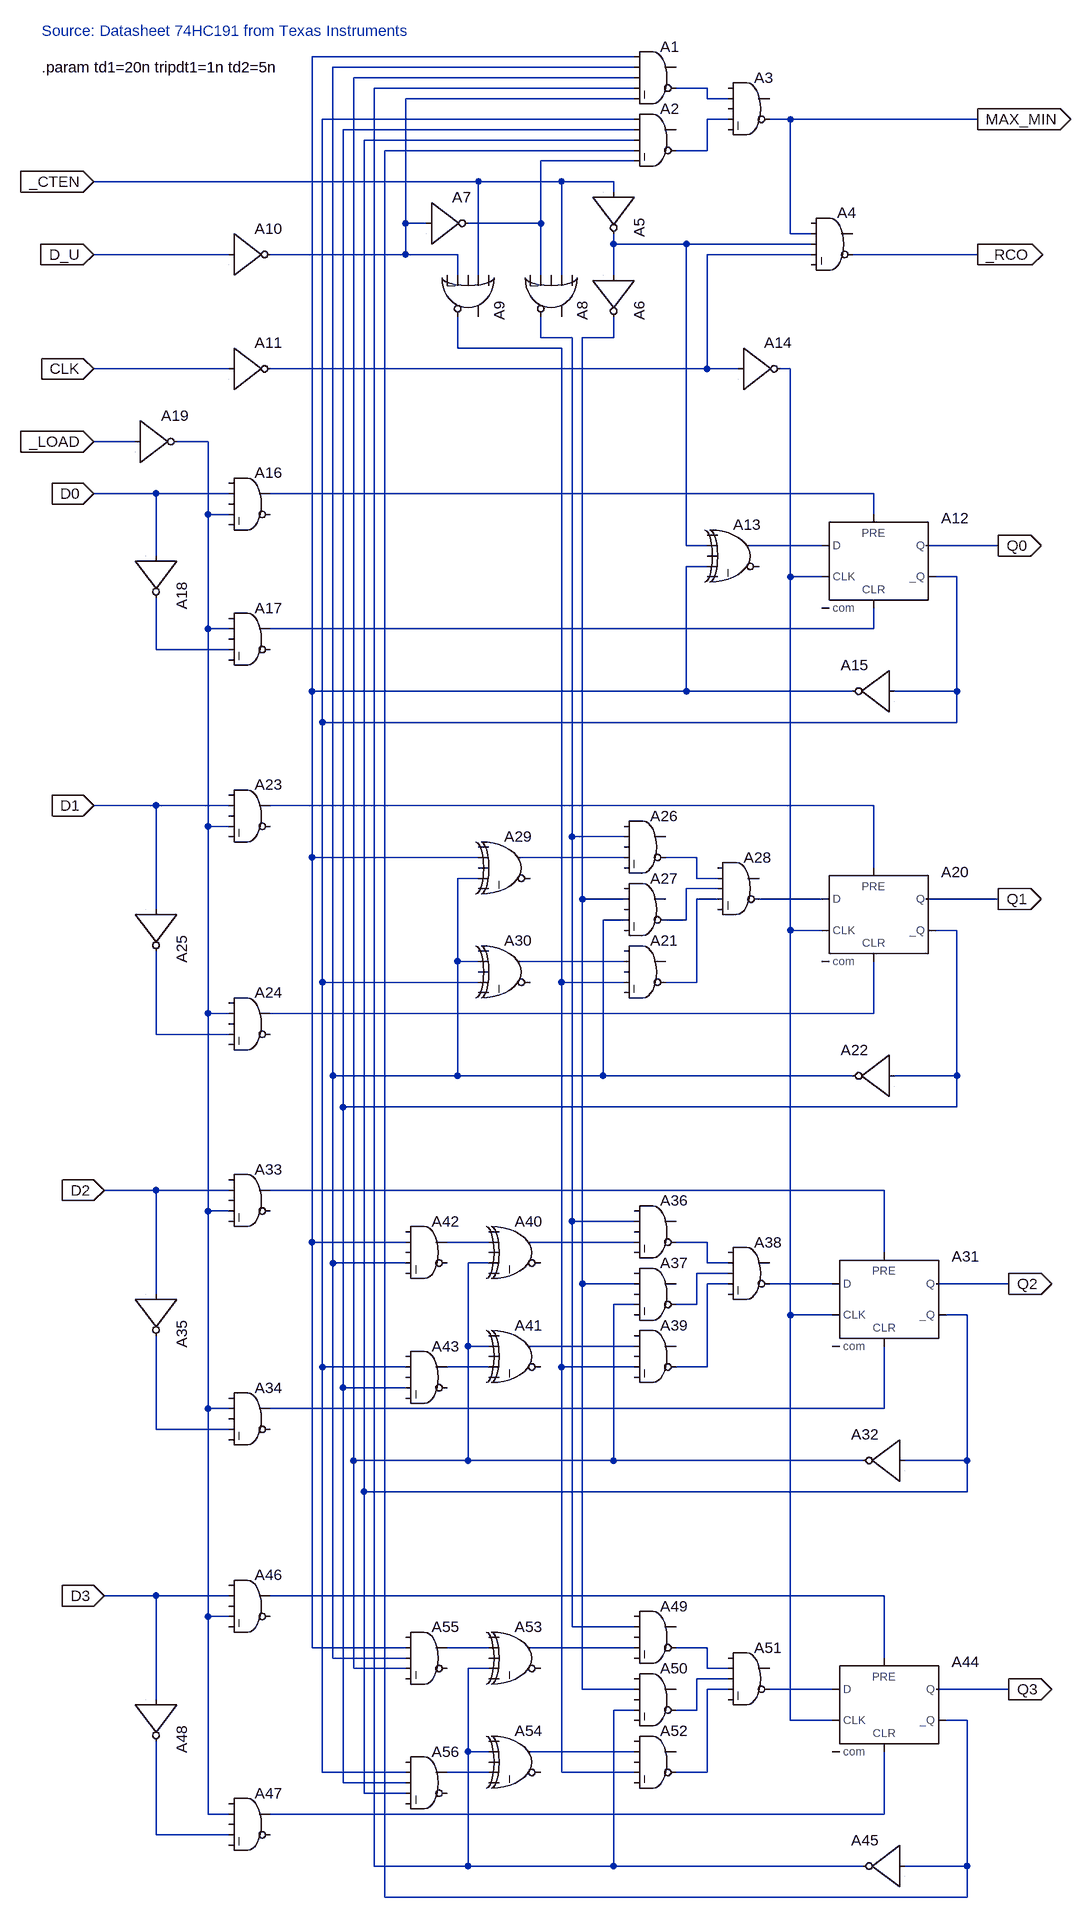
[diagram p0: schematic 74HC191h.asc]
74HC191h.asc, the LTspice schematic file:
Version 4
SHEET 1 884 3140
WIRE -592 624 -656 624
WIRE -560 704 -656 704
WIRE -560 800 -560 704
WIRE -560 944 -560 864
WIRE -560 1184 -656 1184
WIRE -560 1344 -560 1184
WIRE -560 1536 -560 1408
WIRE -560 1776 -640 1776
WIRE -560 1936 -560 1776
WIRE -560 2144 -560 2000
WIRE -560 2400 -640 2400
WIRE -560 2560 -560 2400
WIRE -560 2768 -560 2624
WIRE -480 624 -528 624
WIRE -480 736 -480 624
WIRE -480 912 -480 736
WIRE -480 1216 -480 912
WIRE -480 1504 -480 1216
WIRE -480 1808 -480 1504
WIRE -480 2112 -480 1808
WIRE -480 2432 -480 2112
WIRE -480 2736 -480 2432
WIRE -448 336 -656 336
WIRE -448 512 -656 512
WIRE -448 704 -560 704
WIRE -448 736 -480 736
WIRE -448 912 -480 912
WIRE -448 944 -560 944
WIRE -448 1184 -560 1184
WIRE -448 1216 -480 1216
WIRE -448 1504 -480 1504
WIRE -448 1536 -560 1536
WIRE -448 1776 -560 1776
WIRE -448 1808 -480 1808
WIRE -448 2112 -480 2112
WIRE -448 2144 -560 2144
WIRE -448 2400 -560 2400
WIRE -448 2432 -480 2432
WIRE -448 2736 -480 2736
WIRE -448 2768 -560 2768
WIRE -320 1008 -320 32
WIRE -320 1264 -320 1008
WIRE -320 1856 -320 1264
WIRE -320 2480 -320 1856
WIRE -304 1056 -304 128
WIRE -304 1456 -304 1056
WIRE -304 2048 -304 1456
WIRE -304 2672 -304 2048
WIRE -288 1600 -288 48
WIRE -288 1888 -288 1600
WIRE -288 2496 -288 1888
WIRE -272 1648 -272 144
WIRE -272 2080 -272 1648
WIRE -272 2688 -272 2080
WIRE -256 2192 -256 64
WIRE -256 2512 -256 2192
WIRE -240 2240 -240 160
WIRE -240 2704 -240 2240
WIRE -224 2816 -224 80
WIRE -208 2864 -208 176
WIRE -176 288 -176 96
WIRE -176 336 -384 336
WIRE -176 336 -176 288
WIRE -176 1856 -320 1856
WIRE -176 1888 -288 1888
WIRE -176 2048 -304 2048
WIRE -176 2080 -272 2080
WIRE -176 2480 -320 2480
WIRE -176 2496 -288 2496
WIRE -176 2512 -256 2512
WIRE -176 2672 -304 2672
WIRE -176 2688 -272 2688
WIRE -176 2704 -240 2704
WIRE -144 288 -176 288
WIRE -96 336 -176 336
WIRE -96 368 -96 336
WIRE -96 480 -96 432
WIRE -96 1424 -96 1296
WIRE -96 1600 -288 1600
WIRE -96 1600 -96 1424
WIRE -80 2016 -80 1888
WIRE -80 2192 -256 2192
WIRE -80 2192 -80 2016
WIRE -80 2640 -80 2512
WIRE -80 2816 -224 2816
WIRE -80 2816 -80 2640
WIRE -64 224 -656 224
WIRE -64 368 -64 224
WIRE -64 1264 -320 1264
WIRE -64 1296 -96 1296
WIRE -64 1424 -96 1424
WIRE -64 1456 -304 1456
WIRE -48 1856 -112 1856
WIRE -48 1888 -80 1888
WIRE -48 2016 -80 2016
WIRE -48 2048 -112 2048
WIRE -48 2480 -112 2480
WIRE -48 2512 -80 2512
WIRE -48 2640 -80 2640
WIRE -48 2672 -112 2672
WIRE 32 288 -80 288
WIRE 32 288 32 192
WIRE 32 368 32 288
WIRE 32 464 32 432
WIRE 64 224 -64 224
WIRE 64 368 64 224
WIRE 64 480 -96 480
WIRE 64 1456 64 480
WIRE 64 2048 64 1456
WIRE 64 2672 64 2048
WIRE 80 464 32 464
WIRE 80 1232 80 464
WIRE 80 1824 80 1232
WIRE 80 2448 80 1824
WIRE 96 1328 96 464
WIRE 96 1920 96 1328
WIRE 96 2544 96 1920
WIRE 128 1600 -96 1600
WIRE 128 1600 128 1360
WIRE 144 224 64 224
WIRE 144 240 144 224
WIRE 144 320 144 304
WIRE 144 368 144 320
WIRE 144 464 96 464
WIRE 144 464 144 432
WIRE 144 2192 -80 2192
WIRE 144 2192 144 1952
WIRE 144 2816 -80 2816
WIRE 144 2816 144 2576
WIRE 160 1232 80 1232
WIRE 160 1264 0 1264
WIRE 160 1328 96 1328
WIRE 160 1360 128 1360
WIRE 160 1424 0 1424
WIRE 160 1456 64 1456
WIRE 176 32 -320 32
WIRE 176 48 -288 48
WIRE 176 64 -256 64
WIRE 176 80 -224 80
WIRE 176 96 -176 96
WIRE 176 128 -304 128
WIRE 176 144 -272 144
WIRE 176 160 -240 160
WIRE 176 176 -208 176
WIRE 176 192 32 192
WIRE 176 1824 80 1824
WIRE 176 1856 16 1856
WIRE 176 1920 96 1920
WIRE 176 1952 144 1952
WIRE 176 2016 16 2016
WIRE 176 2048 64 2048
WIRE 176 2448 80 2448
WIRE 176 2480 16 2480
WIRE 176 2544 96 2544
WIRE 176 2576 144 2576
WIRE 176 2640 16 2640
WIRE 176 2672 64 2672
WIRE 256 320 144 320
WIRE 256 784 256 320
WIRE 256 1008 -320 1008
WIRE 256 1008 256 816
WIRE 256 1360 224 1360
WIRE 256 1360 256 1312
WIRE 272 1264 224 1264
WIRE 272 1296 272 1264
WIRE 272 1456 224 1456
WIRE 272 1456 272 1328
WIRE 272 1952 240 1952
WIRE 272 1952 272 1904
WIRE 272 2576 240 2576
WIRE 272 2576 272 2528
WIRE 288 80 240 80
WIRE 288 96 288 80
WIRE 288 176 240 176
WIRE 288 176 288 128
WIRE 288 512 -384 512
WIRE 288 512 288 336
WIRE 288 784 256 784
WIRE 288 816 256 816
WIRE 288 1856 240 1856
WIRE 288 1888 288 1856
WIRE 288 2048 240 2048
WIRE 288 2048 288 1920
WIRE 288 2480 240 2480
WIRE 288 2512 288 2480
WIRE 288 2672 240 2672
WIRE 288 2672 288 2544
WIRE 304 1296 272 1296
WIRE 304 1312 256 1312
WIRE 304 1328 272 1328
WIRE 320 96 288 96
WIRE 320 128 288 128
WIRE 320 1888 288 1888
WIRE 320 1904 272 1904
WIRE 320 1920 288 1920
WIRE 320 2512 288 2512
WIRE 320 2528 272 2528
WIRE 320 2544 288 2544
WIRE 336 512 288 512
WIRE 416 128 384 128
WIRE 416 304 416 128
WIRE 416 512 400 512
WIRE 416 832 416 512
WIRE 416 1376 416 832
WIRE 416 1968 416 1376
WIRE 416 2592 416 1968
WIRE 448 304 416 304
WIRE 448 320 256 320
WIRE 448 336 288 336
WIRE 464 784 352 784
WIRE 464 832 416 832
WIRE 464 1328 368 1328
WIRE 464 1376 416 1376
WIRE 480 1920 384 1920
WIRE 480 1968 416 1968
WIRE 480 2544 384 2544
WIRE 480 2592 416 2592
WIRE 512 1008 256 1008
WIRE 512 1600 128 1600
WIRE 528 2192 144 2192
WIRE 528 2816 144 2816
WIRE 544 704 -384 704
WIRE 544 736 544 704
WIRE 544 912 -384 912
WIRE 544 912 544 880
WIRE 544 1184 -384 1184
WIRE 544 1280 544 1184
WIRE 544 1504 -384 1504
WIRE 544 1504 544 1424
WIRE 560 1776 -384 1776
WIRE 560 1872 560 1776
WIRE 560 2112 -384 2112
WIRE 560 2112 560 2016
WIRE 560 2400 -384 2400
WIRE 560 2496 560 2400
WIRE 560 2736 -384 2736
WIRE 560 2736 560 2640
WIRE 672 832 640 832
WIRE 672 1008 576 1008
WIRE 672 1008 672 832
WIRE 672 1056 -304 1056
WIRE 672 1056 672 1008
WIRE 672 1376 640 1376
WIRE 672 1600 576 1600
WIRE 672 1600 672 1376
WIRE 672 1648 -272 1648
WIRE 672 1648 672 1600
WIRE 688 1968 656 1968
WIRE 688 2192 592 2192
WIRE 688 2192 688 1968
WIRE 688 2240 -240 2240
WIRE 688 2240 688 2192
WIRE 688 2592 656 2592
WIRE 688 2816 592 2816
WIRE 688 2816 688 2592
WIRE 688 2864 -208 2864
WIRE 688 2864 688 2816
WIRE 704 128 416 128
WIRE 704 336 512 336
WIRE 736 784 624 784
WIRE 736 1328 624 1328
WIRE 752 1920 640 1920
WIRE 752 2544 640 2544
FLAG -656 224 _CTEN
IOPIN -656 224 In
FLAG -656 336 D_U
IOPIN -656 336 In
FLAG -656 512 CLK
IOPIN -656 512 In
FLAG -656 624 _LOAD
IOPIN -656 624 In
FLAG -656 704 D0
IOPIN -656 704 In
FLAG -656 1184 D1
IOPIN -656 1184 In
FLAG -640 1776 D2
IOPIN -640 1776 In
FLAG 704 128 MAX_MIN
IOPIN 704 128 Out
FLAG 704 336 _RCO
IOPIN 704 336 Out
FLAG 736 784 Q0
IOPIN 736 784 Out
FLAG 736 1328 Q1
IOPIN 736 1328 Out
FLAG 752 1920 Q2
IOPIN 752 1920 Out
FLAG 752 2544 Q3
IOPIN 752 2544 Out
FLAG -640 2400 D3
IOPIN -640 2400 In
SYMBOL Digital\\and 208 0 R0
SYMATTR InstName A1
SYMATTR Value2 tripdt={tripdt1}  td={td2}
SYMBOL Digital\\and 208 96 R0
SYMATTR InstName A2
SYMATTR Value2 tripdt={tripdt1}  td={td2}
SYMBOL Digital\\and 352 48 R0
SYMATTR InstName A3
SYMATTR Value2 tripdt={tripdt1}  td={td2}
SYMBOL Digital\\and 480 256 R0
SYMATTR InstName A4
SYMATTR Value2 tripdt={tripdt1}  td={td2}
SYMBOL Digital\\inv 208 240 R90
SYMATTR InstName A5
SYMATTR Value2 tripdt={tripdt1}  td={td2}
SYMBOL Digital\\inv 208 368 R90
SYMATTR InstName A6
SYMATTR Value2 tripdt={tripdt1}  td={td2}
SYMBOL Digital\\inv -144 224 R0
SYMATTR InstName A7
SYMBOL Digital\\or 112 400 R90
SYMATTR InstName A8
SYMATTR Value2 tripdt={tripdt1}  td={td2}
SYMBOL Digital\\or -16 400 R90
SYMATTR InstName A9
SYMATTR Value2 tripdt={tripdt1}  td={td2}
SYMBOL Digital\\inv -448 272 R0
SYMATTR InstName A10
SYMATTR Value2 tripdt={tripdt1}  td={td2}
SYMBOL Digital\\inv -448 448 R0
SYMATTR InstName A11
SYMATTR Value2 tripdt={tripdt1}  td={td2}
SYMBOL Digital\\dflop 544 736 R0
SYMATTR InstName A12
SYMATTR Value2 tripdt={tripdt1}  td={td1}
SYMBOL Digital\\xor 336 736 R0
SYMATTR InstName A13
SYMATTR Value2 tripdt={tripdt1}  td={td2}
SYMBOL Digital\\inv 576 944 M0
SYMATTR InstName A15
SYMBOL Digital\\inv 336 448 R0
SYMATTR InstName A14
SYMBOL Digital\\and -416 656 R0
SYMATTR InstName A16
SYMATTR Value2 tripdt={tripdt1}  td={td2}
SYMBOL Digital\\and -416 864 R0
SYMATTR InstName A17
SYMATTR Value2 tripdt={tripdt1}  td={td2}
SYMBOL Digital\\inv -496 800 R90
SYMATTR InstName A18
SYMBOL Digital\\inv -592 560 R0
SYMATTR InstName A19
SYMATTR Value2 tripdt={tripdt1}  td={td2}
SYMBOL Digital\\dflop 544 1280 R0
SYMATTR InstName A20
SYMATTR Value2 tripdt={tripdt1}  td={td1}
SYMBOL Digital\\inv 576 1536 M0
SYMATTR InstName A22
SYMBOL Digital\\and -416 1136 R0
SYMATTR InstName A23
SYMATTR Value2 tripdt={tripdt1}  td={td2}
SYMBOL Digital\\and -416 1456 R0
SYMATTR InstName A24
SYMATTR Value2 tripdt={tripdt1}  td={td2}
SYMBOL Digital\\inv -496 1344 R90
SYMATTR InstName A25
SYMBOL Digital\\and 192 1184 R0
SYMATTR InstName A26
SYMATTR Value2 tripdt={tripdt1}  td={td2}
SYMBOL Digital\\and 192 1280 R0
SYMATTR InstName A27
SYMATTR Value2 tripdt={tripdt1}  td={td2}
SYMBOL Digital\\and 336 1248 R0
SYMATTR InstName A28
SYMATTR Value2 tripdt={tripdt1}  td={td2}
SYMBOL Digital\\and 192 1376 R0
SYMATTR InstName A21
SYMATTR Value2 tripdt={tripdt1}  td={td2}
SYMBOL Digital\\xor -16 1216 R0
SYMATTR InstName A29
SYMATTR Value2 tripdt={tripdt1}  td={td2}
SYMBOL Digital\\xor -16 1376 R0
SYMATTR InstName A30
SYMATTR Value2 tripdt={tripdt1}  td={td2}
SYMBOL Digital\\dflop 560 1872 R0
SYMATTR InstName A31
SYMATTR Value2 tripdt={tripdt1}  td={td1}
SYMBOL Digital\\inv 592 2128 M0
SYMATTR InstName A32
SYMBOL Digital\\and -416 1728 R0
SYMATTR InstName A33
SYMATTR Value2 tripdt={tripdt1}  td={td2}
SYMBOL Digital\\and -416 2064 R0
SYMATTR InstName A34
SYMATTR Value2 tripdt={tripdt1}  td={td2}
SYMBOL Digital\\inv -496 1936 R90
SYMATTR InstName A35
SYMBOL Digital\\and 208 1776 R0
SYMATTR InstName A36
SYMATTR Value2 tripdt={tripdt1}  td={td2}
SYMBOL Digital\\and 208 1872 R0
SYMATTR InstName A37
SYMATTR Value2 tripdt={tripdt1}  td={td2}
SYMBOL Digital\\and 352 1840 R0
SYMATTR InstName A38
SYMATTR Value2 tripdt={tripdt1}  td={td2}
SYMBOL Digital\\and 208 1968 R0
SYMATTR InstName A39
SYMATTR Value2 tripdt={tripdt1}  td={td2}
SYMBOL Digital\\xor 0 1808 R0
SYMATTR InstName A40
SYMATTR Value2 tripdt={tripdt1}  td={td2}
SYMBOL Digital\\xor 0 1968 R0
SYMATTR InstName A41
SYMATTR Value2 tripdt={tripdt1}  td={td2}
SYMBOL Digital\\and -144 1808 R0
SYMATTR InstName A42
SYMATTR Value2 tripdt={tripdt1}  td={td2}
SYMBOL Digital\\and -144 2000 R0
SYMATTR InstName A43
SYMATTR Value2 tripdt={tripdt1}  td={td2}
SYMBOL Digital\\dflop 560 2496 R0
SYMATTR InstName A44
SYMATTR Value2 tripdt={tripdt1}  td={td1}
SYMBOL Digital\\inv 592 2752 M0
SYMATTR InstName A45
SYMBOL Digital\\and -416 2352 R0
SYMATTR InstName A46
SYMATTR Value2 tripdt={tripdt1}  td={td2}
SYMBOL Digital\\and -416 2688 R0
SYMATTR InstName A47
SYMATTR Value2 tripdt={tripdt1}  td={td2}
SYMBOL Digital\\inv -496 2560 R90
SYMATTR InstName A48
SYMBOL Digital\\and 208 2400 R0
SYMATTR InstName A49
SYMATTR Value2 tripdt={tripdt1}  td={td2}
SYMBOL Digital\\and 208 2496 R0
SYMATTR InstName A50
SYMATTR Value2 tripdt={tripdt1}  td={td2}
SYMBOL Digital\\and 352 2464 R0
SYMATTR InstName A51
SYMATTR Value2 tripdt={tripdt1}  td={td2}
SYMBOL Digital\\and 208 2592 R0
SYMATTR InstName A52
SYMATTR Value2 tripdt={tripdt1}  td={td2}
SYMBOL Digital\\xor 0 2432 R0
SYMATTR InstName A53
SYMATTR Value2 tripdt={tripdt1}  td={td2}
SYMBOL Digital\\xor 0 2592 R0
SYMATTR InstName A54
SYMATTR Value2 tripdt={tripdt1}  td={td2}
SYMBOL Digital\\and -144 2432 R0
SYMATTR InstName A55
SYMATTR Value2 tripdt={tripdt1}  td={td2}
SYMBOL Digital\\and -144 2624 R0
SYMATTR InstName A56
SYMATTR Value2 tripdt={tripdt1}  td={td2}
TEXT -736 48 Left 0 !.param td1=20n tripdt1=1n td2=5n
TEXT -736 -8 Left 0 ;Source: Datasheet 74HC191 from Texas Instruments

The netlist it stands for:
* 74HC191h.asc
A1 N006 N008 N010 N012 N014 N035 0 0 AND tripdt={tripdt1}  td={td2}
A2 N007 N009 N011 N013 N020 N036 0 0 AND tripdt={tripdt1}  td={td2}
A3 0 N035 0 N036 0 MAX_MIN 0 0 AND tripdt={tripdt1}  td={td2}
A4 0 MAX_MIN N023 N037 0 _RCO 0 0 AND tripdt={tripdt1}  td={td2}
A5 _CTEN 0 0 0 0 N023 0 0 BUF tripdt={tripdt1}  td={td2}
A6 N023 0 0 0 0 N022 0 0 BUF tripdt={tripdt1}  td={td2}
A7 N014 0 0 0 0 N020 0 0 BUF
A8 0 _CTEN 0 N020 0 N021 0 0 OR tripdt={tripdt1}  td={td2}
A9 0 _CTEN 0 N014 0 N015 0 0 OR tripdt={tripdt1}  td={td2}
A10 D_U 0 0 0 0 N014 0 0 BUF tripdt={tripdt1}  td={td2}
A11 CLK 0 0 0 0 N037 0 0 BUF tripdt={tripdt1}  td={td2}
A12 N043 0 N042 N047 N048 N007 Q0 0 DFLOP tripdt={tripdt1}  td={td1}
A13 0 N023 0 N006 0 0 N043 0 XOR tripdt={tripdt1}  td={td2}
A15 N007 0 0 0 0 N006 0 0 BUF
A14 N037 0 0 0 0 N042 0 0 BUF
A16 0 D0 0 N005 0 0 N047 0 AND tripdt={tripdt1}  td={td2}
A17 0 N005 0 N001 0 0 N048 0 AND tripdt={tripdt1}  td={td2}
A18 D0 0 0 0 0 N001 0 0 BUF
A19 _LOAD 0 0 0 0 N005 0 0 BUF tripdt={tripdt1}  td={td2}
A20 N044 0 N042 N049 N050 N009 Q1 0 DFLOP tripdt={tripdt1}  td={td1}
A22 N009 0 0 0 0 N008 0 0 BUF
A23 0 D1 0 N005 0 0 N049 0 AND tripdt={tripdt1}  td={td2}
A24 0 N005 0 N002 0 0 N050 0 AND tripdt={tripdt1}  td={td2}
A25 D1 0 0 0 0 N002 0 0 BUF
A26 0 N021 0 N024 0 N031 0 0 AND tripdt={tripdt1}  td={td2}
A27 0 N022 0 N008 0 N030 0 0 AND tripdt={tripdt1}  td={td2}
A28 0 N031 N030 N032 0 N044 0 0 AND tripdt={tripdt1}  td={td2}
A21 0 N025 0 N015 0 N032 0 0 AND tripdt={tripdt1}  td={td2}
A29 0 N006 0 N008 0 0 N024 0 XOR tripdt={tripdt1}  td={td2}
A30 0 N008 0 N007 0 0 N025 0 XOR tripdt={tripdt1}  td={td2}
A31 N045 0 N042 N051 N052 N011 Q2 0 DFLOP tripdt={tripdt1}  td={td1}
A32 N011 0 0 0 0 N010 0 0 BUF
A33 0 D2 0 N005 0 0 N051 0 AND tripdt={tripdt1}  td={td2}
A34 0 N005 0 N003 0 0 N052 0 AND tripdt={tripdt1}  td={td2}
A35 D2 0 0 0 0 N003 0 0 BUF
A36 0 N021 0 N026 0 N038 0 0 AND tripdt={tripdt1}  td={td2}
A37 0 N022 0 N010 0 N033 0 0 AND tripdt={tripdt1}  td={td2}
A38 0 N038 N033 N039 0 N045 0 0 AND tripdt={tripdt1}  td={td2}
A39 0 N027 0 N015 0 N039 0 0 AND tripdt={tripdt1}  td={td2}
A40 0 N016 0 N010 0 0 N026 0 XOR tripdt={tripdt1}  td={td2}
A41 0 N010 0 N017 0 0 N027 0 XOR tripdt={tripdt1}  td={td2}
A42 0 N006 0 N008 0 0 N016 0 AND tripdt={tripdt1}  td={td2}
A43 0 N007 0 N009 0 0 N017 0 AND tripdt={tripdt1}  td={td2}
A44 N046 0 N042 N053 N054 N013 Q3 0 DFLOP tripdt={tripdt1}  td={td1}
A45 N013 0 0 0 0 N012 0 0 BUF
A46 0 D3 0 N005 0 0 N053 0 AND tripdt={tripdt1}  td={td2}
A47 0 N005 0 N004 0 0 N054 0 AND tripdt={tripdt1}  td={td2}
A48 D3 0 0 0 0 N004 0 0 BUF
A49 0 N021 0 N028 0 N040 0 0 AND tripdt={tripdt1}  td={td2}
A50 0 N022 0 N012 0 N034 0 0 AND tripdt={tripdt1}  td={td2}
A51 0 N040 N034 N041 0 N046 0 0 AND tripdt={tripdt1}  td={td2}
A52 0 N029 0 N015 0 N041 0 0 AND tripdt={tripdt1}  td={td2}
A53 0 N018 0 N012 0 0 N028 0 XOR tripdt={tripdt1}  td={td2}
A54 0 N012 0 N019 0 0 N029 0 XOR tripdt={tripdt1}  td={td2}
A55 0 N006 N008 N010 0 0 N018 0 AND tripdt={tripdt1}  td={td2}
A56 0 N007 N009 N011 0 0 N019 0 AND tripdt={tripdt1}  td={td2}
.param td1=20n tripdt1=1n td2=5n
* Source: Datasheet 74HC191 from Texas Instruments
.backanno
.end